# EAGLE design Converter (EAGLE 9.2.2)

## Sheet 1 of 4: Connectors & Caps
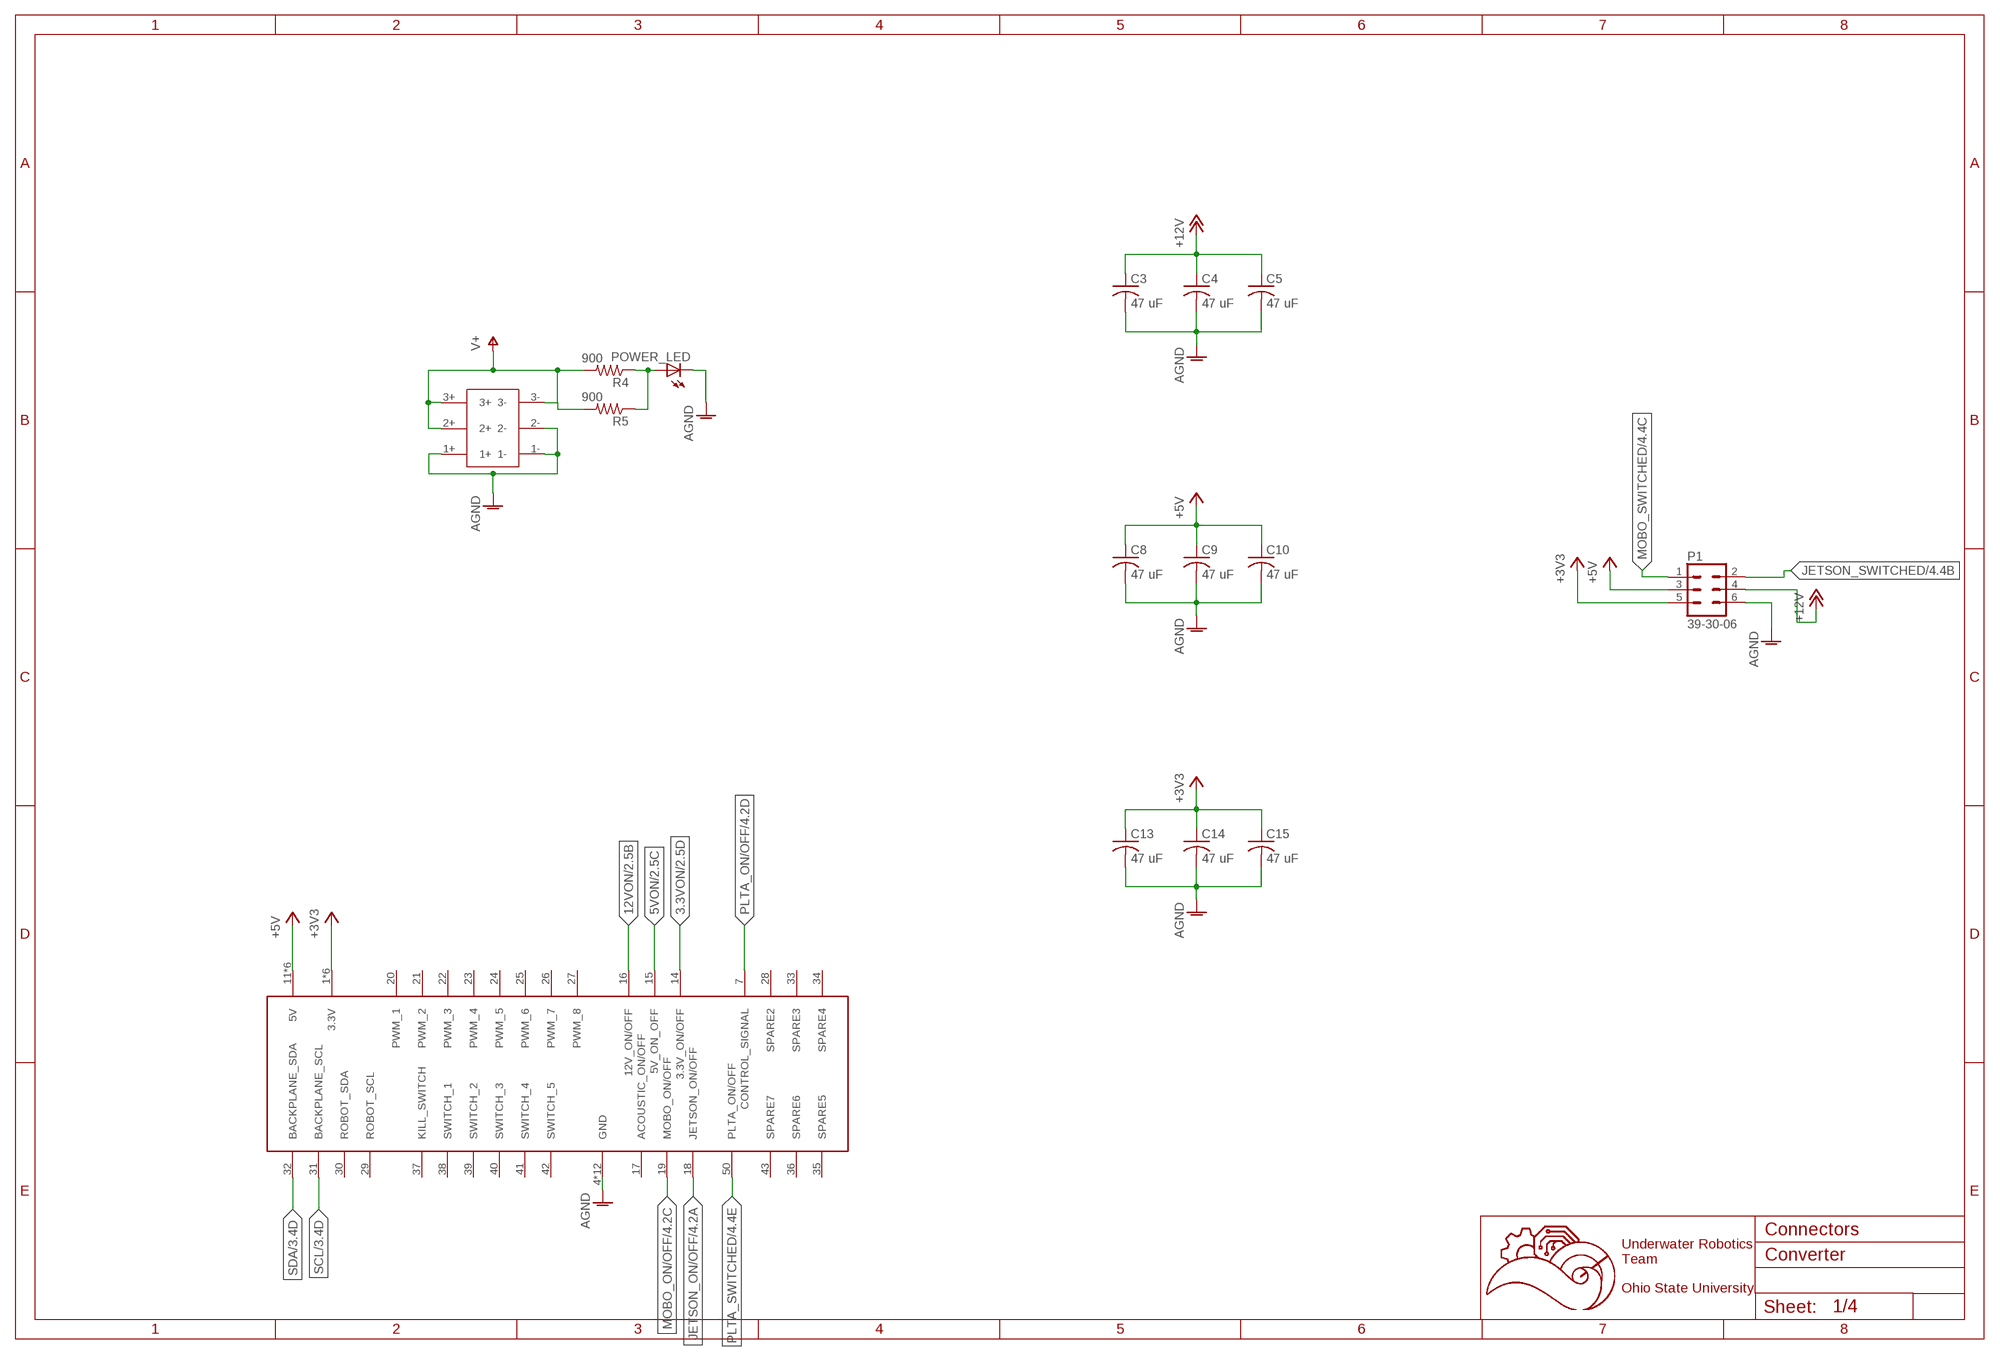
[diagram p0: schematic, sheet 1]

### Parts
C3  47 uF  C-USC1206K  [C1206K]
C4  47 uF  C-USC1206K  [C1206K]
C5  47 uF  C-USC1206K  [C1206K]
C8  47 uF  C-USC1206K  [C1206K]
C9  47 uF  C-USC1206K  [C1206K]
C10  47 uF  C-USC1206K  [C1206K]
C13  47 uF  C-USC1206K  [C1206K]
C14  47 uF  C-USC1206K  [C1206K]
C15  47 uF  C-USC1206K  [C1206K]
P1  39-30-06  [39-30-?06?]
POWER_LED  LEDCHIPLED_0603  [CHIPLED_0603]
R4  900  R-US_R0603  [R0603]
R5  900  R-US_R0603  [R0603]
U$1  5530843-EDGE  [5530843-6-BOARDFINGERS]
U$3  6PIN-VERT  [6PIN_VERT]

### Nets
3.3VON: U$1.14(3.3V_ON/OFF) ; also sheet 2
5VON: U$1.15(5V_ON_OFF) ; also sheet 2
12VON: U$1.16(12V_ON/OFF) ; also sheet 2
+3V3: C13.1 C14.1 C15.1 P1.5 U$1.1(3.3V) U$1.2(3.3V) U$1.3(3.3V) U$1.54(3.3V) U$1.55(3.3V) U$1.56(3.3V) ; also sheet 2,3
+5V: C8.1 C9.1 C10.1 P1.3 U$1.11(5V) U$1.12(5V) U$1.13(5V) U$1.44(5V) U$1.45(5V) U$1.46(5V) ; also sheet 2,3,4
+12V: C3.1 C4.1 C5.1 P1.4 ; also sheet 2,3,4
AGND: C3.2 C4.2 C5.2 C8.2 C9.2 C10.2 C13.2 C14.2 C15.2 P1.6 POWER_LED.C U$1.4(GND) U$1.5(GND) U$1.6(GND) U$1.8(GND) U$1.9(GND) U$1.10(GND) U$1.47(GND) U$1.48(GND) U$1.49(GND) U$1.51(GND) U$1.52(GND) U$1.53(GND) U$3.1+ U$3.1- U$3.2- ; also sheet 2,3,4
JETSON_ON/OFF: U$1.18(JETSON_ON/OFF) ; also sheet 4
JETSON_SWITCHED: P1.2 ; also sheet 4
MOBO_ON/OFF: U$1.19(MOBO_ON/OFF) ; also sheet 4
MOBO_SWITCHED: P1.1 ; also sheet 4
N$20: POWER_LED.A R4.1 R5.1
PLTA_ON/OFF: U$1.7(CONTROL_SIGNAL) ; also sheet 4
PLTA_SWITCHED: U$1.50(PLTA_ON/OFF) ; also sheet 4
SCL: U$1.31(BACKPLANE_SCL) ; also sheet 3
SDA: U$1.32(BACKPLANE_SDA) ; also sheet 3
V+: R4.2 R5.2 U$3.2+ U$3.3+ U$3.3- ; also sheet 2
Unconnected: U$1.17(ACOUSTIC_ON/OFF) U$1.20(PWM_1) U$1.21(PWM_2) U$1.22(PWM_3) U$1.23(PWM_4) U$1.24(PWM_5) U$1.25(PWM_6) U$1.26(PWM_7) U$1.27(PWM_8) U$1.28(SPARE2) U$1.29(ROBOT_SCL) U$1.30(ROBOT_SDA) U$1.33(SPARE3) U$1.34(SPARE4) U$1.35(SPARE5) U$1.36(SPARE6) U$1.37(KILL_SWITCH) U$1.38(SWITCH_1) U$1.39(SWITCH_2) U$1.40(SWITCH_3) U$1.41(SWITCH_4) U$1.42(SWITCH_5) U$1.43(SPARE7)

### Notes on the sheet
- Connectors
- Underwater Robotics
  Team
  
  Ohio State University

## Sheet 2 of 4: Converter
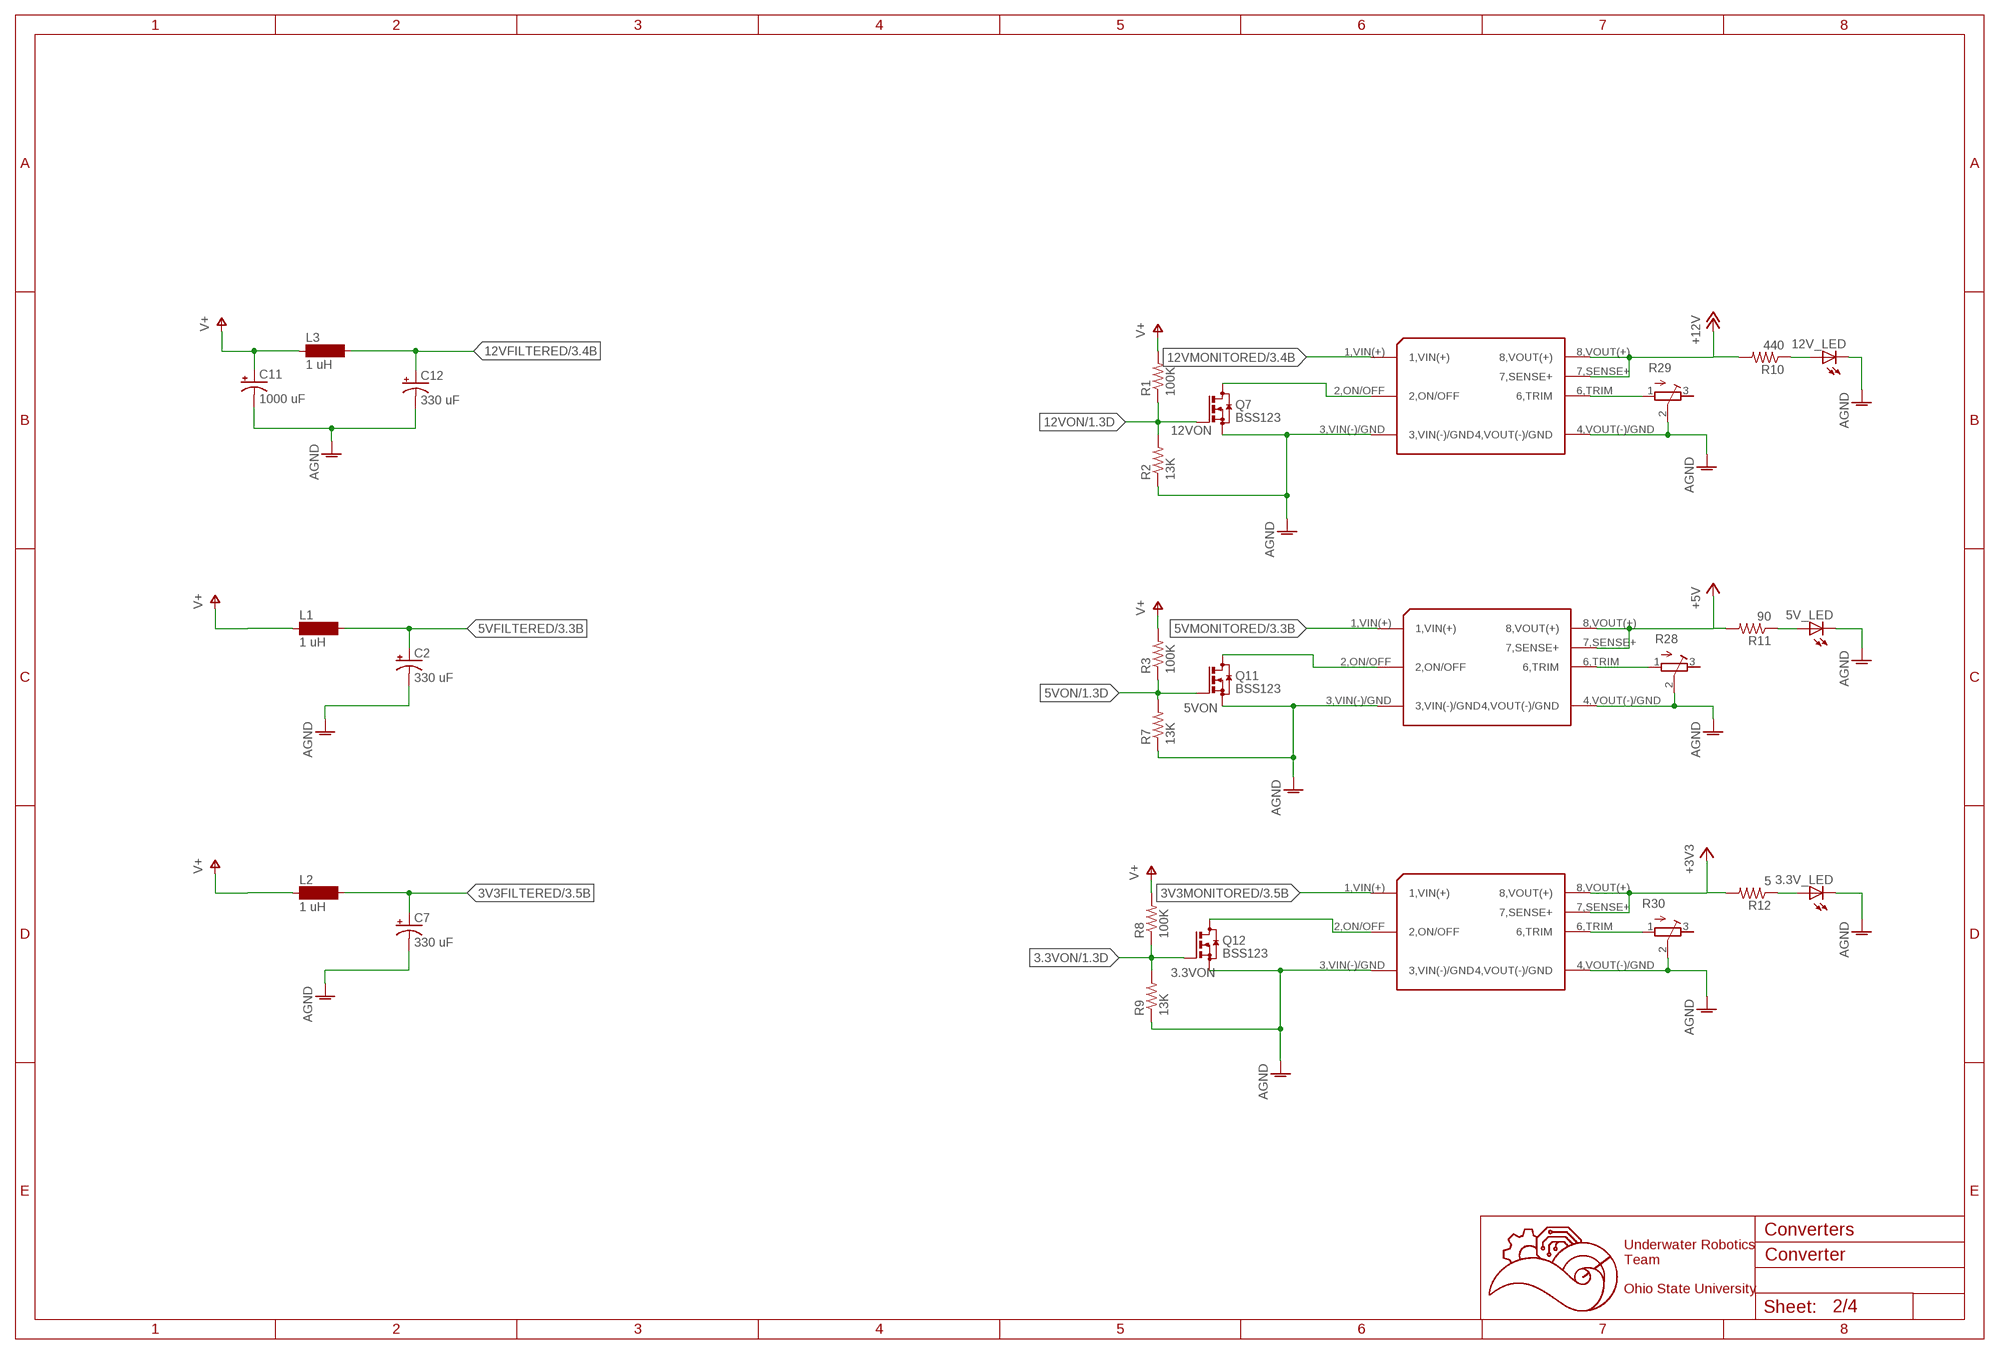
[diagram p1: schematic, sheet 2]

### Parts
3.3V_LED  LEDCHIPLED_0603  [CHIPLED_0603]
3.3VCONVERTER  CONVERTER  [CONVERTER]
5V_LED  LEDCHIPLED_0603  [CHIPLED_0603]
5VCONVERTER  CONVERTER  [CONVERTER]
12V_LED  LEDCHIPLED_0603  [CHIPLED_0603]
12VCONVERTER  CONVERTER  [CONVERTER]
C2  330 uF  CPOL-USE5-10.5  [E5-10,5]
C7  330 uF  CPOL-USE5-10.5  [E5-10,5]
C11  1000 uF  CPOL-USE5-13  [E5-13]
C12  330 uF  CPOL-USE5-10.5  [E5-10,5]
L1  1 uH  MS85  [MS85]
L2  1 uH  MS85  [MS85]
L3  1 uH  MS85  [MS85]
Q7  BSS123  [SOT23]
Q11  BSS123  [SOT23]
Q12  BSS123  [SOT23]
R1  100K  R-US_R0603  [R0603]
R2  13K  R-US_R0603  [R0603]
R3  100K  R-US_R0603  [R0603]
R7  13K  R-US_R0603  [R0603]
R8  100K  R-US_R0603  [R0603]
R9  13K  R-US_R0603  [R0603]
R10  440  R-US_R0603  [R0603]
R11  90  R-US_R0603  [R0603]
R12  5  R-US_R0603  [R0603]
R28  R-TRIMM3103  [RTRIM3103]
R29  R-TRIMM3103  [RTRIM3103]
R30  R-TRIMM3103  [RTRIM3103]

### Nets
3.3VON: Q12.1(G) R8.1 R9.2 ; also sheet 1
3V3FILTERED: C7.+ L2.2 ; also sheet 3
3V3MONITORED: 3.3VCONVERTER.1,VIN(+) ; also sheet 3
5VFILTERED: C2.+ L1.2 ; also sheet 3
5VMONITORED: 5VCONVERTER.1,VIN(+) ; also sheet 3
5VON: Q11.1(G) R3.1 R7.2 ; also sheet 1
12VFILTERED: C12.+ L3.2 ; also sheet 3
12VMONITORED: 12VCONVERTER.1,VIN(+) ; also sheet 3
12VON: Q7.1(G) R1.1 R2.2 ; also sheet 1
+3V3: 3.3VCONVERTER.7,SENSE+ 3.3VCONVERTER.8,VOUT(+) R12.2 ; also sheet 1,3
+5V: 5VCONVERTER.7,SENSE+ 5VCONVERTER.8,VOUT(+) R11.2 ; also sheet 1,3,4
+12V: 12VCONVERTER.7,SENSE+ 12VCONVERTER.8,VOUT(+) R10.2 ; also sheet 1,3,4
AGND: 3.3V_LED.C 3.3VCONVERTER.3,VIN(-)/GND 3.3VCONVERTER.4,VOUT(-)/GND 5V_LED.C 5VCONVERTER.3,VIN(-)/GND 5VCONVERTER.4,VOUT(-)/GND 12V_LED.C 12VCONVERTER.3,VIN(-)/GND 12VCONVERTER.4,VOUT(-)/GND C2.- C7.- C11.- C12.- Q7.2(S) Q11.2(S) Q12.2(S) R2.1 R7.1 R9.1 R28.2(S) R29.2(S) R30.2(S) ; also sheet 1,3,4
N$1: 12VCONVERTER.6,TRIM R29.1(A)
N$2: 5VCONVERTER.6,TRIM R28.1(A)
N$3: 3.3VCONVERTER.6,TRIM R30.1(A)
N$4: 3.3VCONVERTER.2,ON/OFF Q12.3(D)
N$5: 12V_LED.A R10.1
N$6: 5V_LED.A R11.1
N$7: 3.3V_LED.A R12.1
N$18: 12VCONVERTER.2,ON/OFF Q7.3(D)
N$19: 5VCONVERTER.2,ON/OFF Q11.3(D)
V+: C11.+ L1.1 L2.1 L3.1 R1.2 R3.2 R8.2 ; also sheet 1
Unconnected: R28.3(E) R29.3(E) R30.3(E)

### Notes on the sheet
- Converters
- Underwater Robotics
  Team
  
  Ohio State University
- C:/Users/blain/Downloads/Black and White.bmp

## Sheet 3 of 4
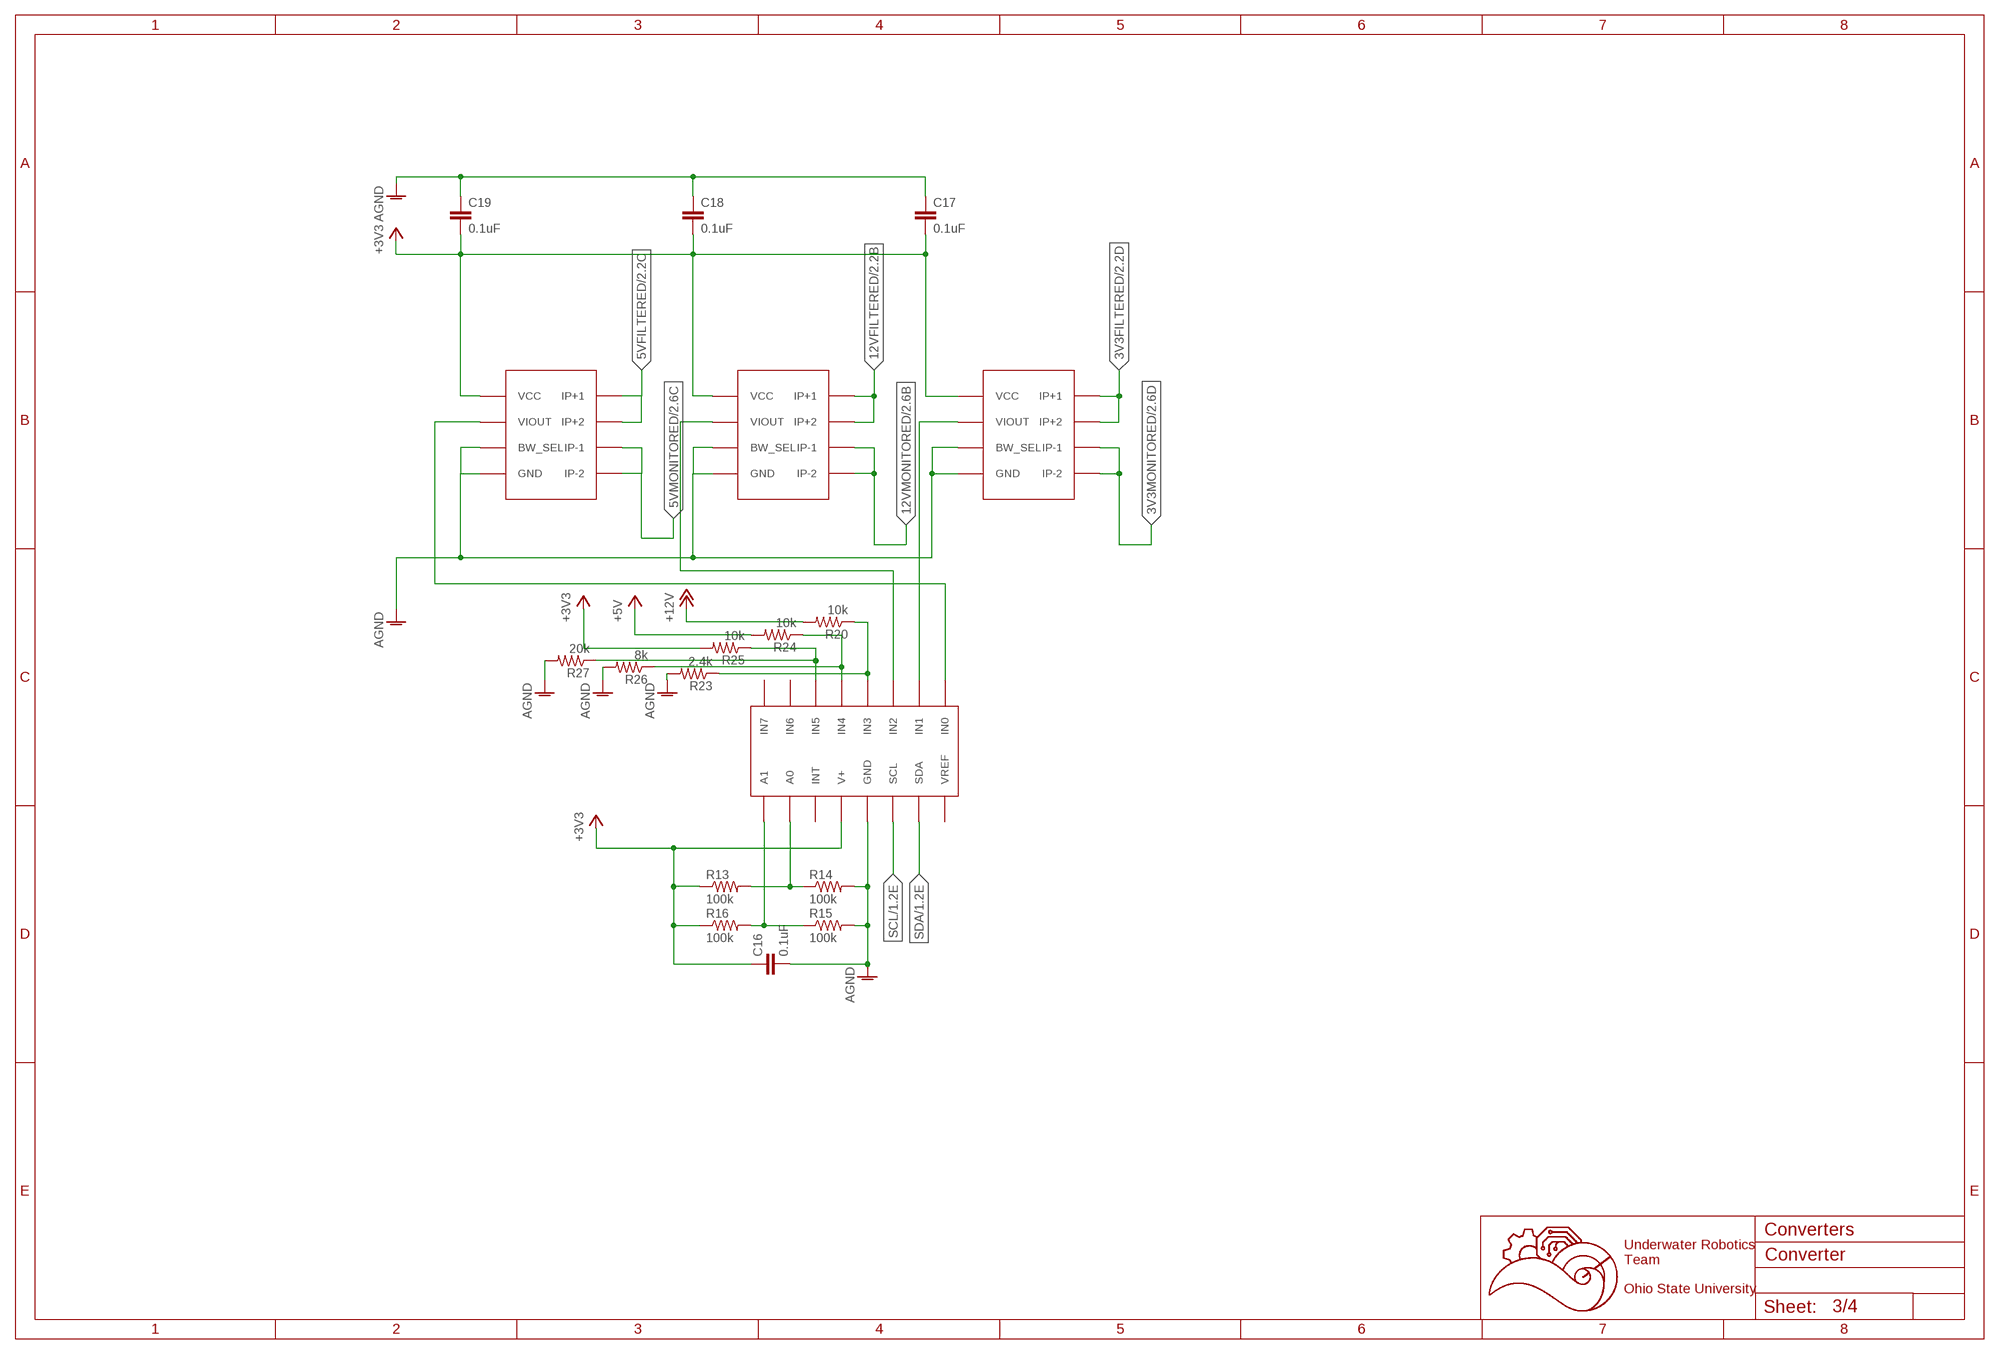
[diagram p2: schematic, sheet 3]

### Parts
1C  ACS722  [SOIC-8]
1C1  ACS722  [SOIC-8]
1C2  ACS722  [SOIC-8]
C16  0.1uF  C-EUC0603  [C0603]
C17  0.1uF  C-EUC0603  [C0603]
C18  0.1uF  C-EUC0603  [C0603]
C19  0.1uF  C-EUC0603  [C0603]
R13  100k  R-US_R0603  [R0603]
R14  100k  R-US_R0603  [R0603]
R15  100k  R-US_R0603  [R0603]
R16  100k  R-US_R0603  [R0603]
R20  10k  R-US_R0603  [R0603]
R23  2.4k  R-US_R0603  [R0603]
R24  10k  R-US_R0603  [R0603]
R25  10k  R-US_R0603  [R0603]
R26  8k  R-US_R0603  [R0603]
R27  20k  R-US_R0603  [R0603]
U$2  ADC128D818  [TSSOP-16]

### Nets
3V3FILTERED: 1C2.IP+1 1C2.IP+2 ; also sheet 2
3V3MONITORED: 1C2.IP-1 1C2.IP-2 ; also sheet 2
5VFILTERED: 1C.IP+1 1C.IP+2 ; also sheet 2
5VMONITORED: 1C.IP-1 1C.IP-2 ; also sheet 2
12VFILTERED: 1C1.IP+1 1C1.IP+2 ; also sheet 2
12VMONITORED: 1C1.IP-1 1C1.IP-2 ; also sheet 2
+3V3: 1C1.VCC 1C2.VCC 1C.VCC C16.1 C17.2 C18.2 C19.2 R13.1 R16.1 R25.2 U$2.V+ ; also sheet 1,2
+5V: R24.2 ; also sheet 1,2,4
+12V: R20.2 ; also sheet 1,2,4
AGND: 1C1.BW_SEL 1C1.GND 1C2.BW_SEL 1C2.GND 1C.BW_SEL 1C.GND C16.2 C17.1 C18.1 C19.1 R14.2 R15.2 R23.2 R26.2 R27.2 U$2.GND ; also sheet 1,2,4
N$11: 1C.VIOUT U$2.IN0
N$12: 1C1.VIOUT U$2.IN2
N$13: 1C2.VIOUT U$2.IN1
N$16: R24.1 R26.1 U$2.IN4
N$17: R25.1 R27.1 U$2.IN5
N$21: R20.1 R23.1 U$2.IN3
N$44: R13.2 R14.1 U$2.A0
N$46: R15.1 R16.2 U$2.A1
SCL: U$2.SCL ; also sheet 1
SDA: U$2.SDA ; also sheet 1
Unconnected: U$2.IN6 U$2.IN7 U$2.INT U$2.VREF

### Notes on the sheet
- Converters
- Underwater Robotics
  Team
  
  Ohio State University
- C:/Users/blain/Downloads/Black and White.bmp

## Sheet 4 of 4
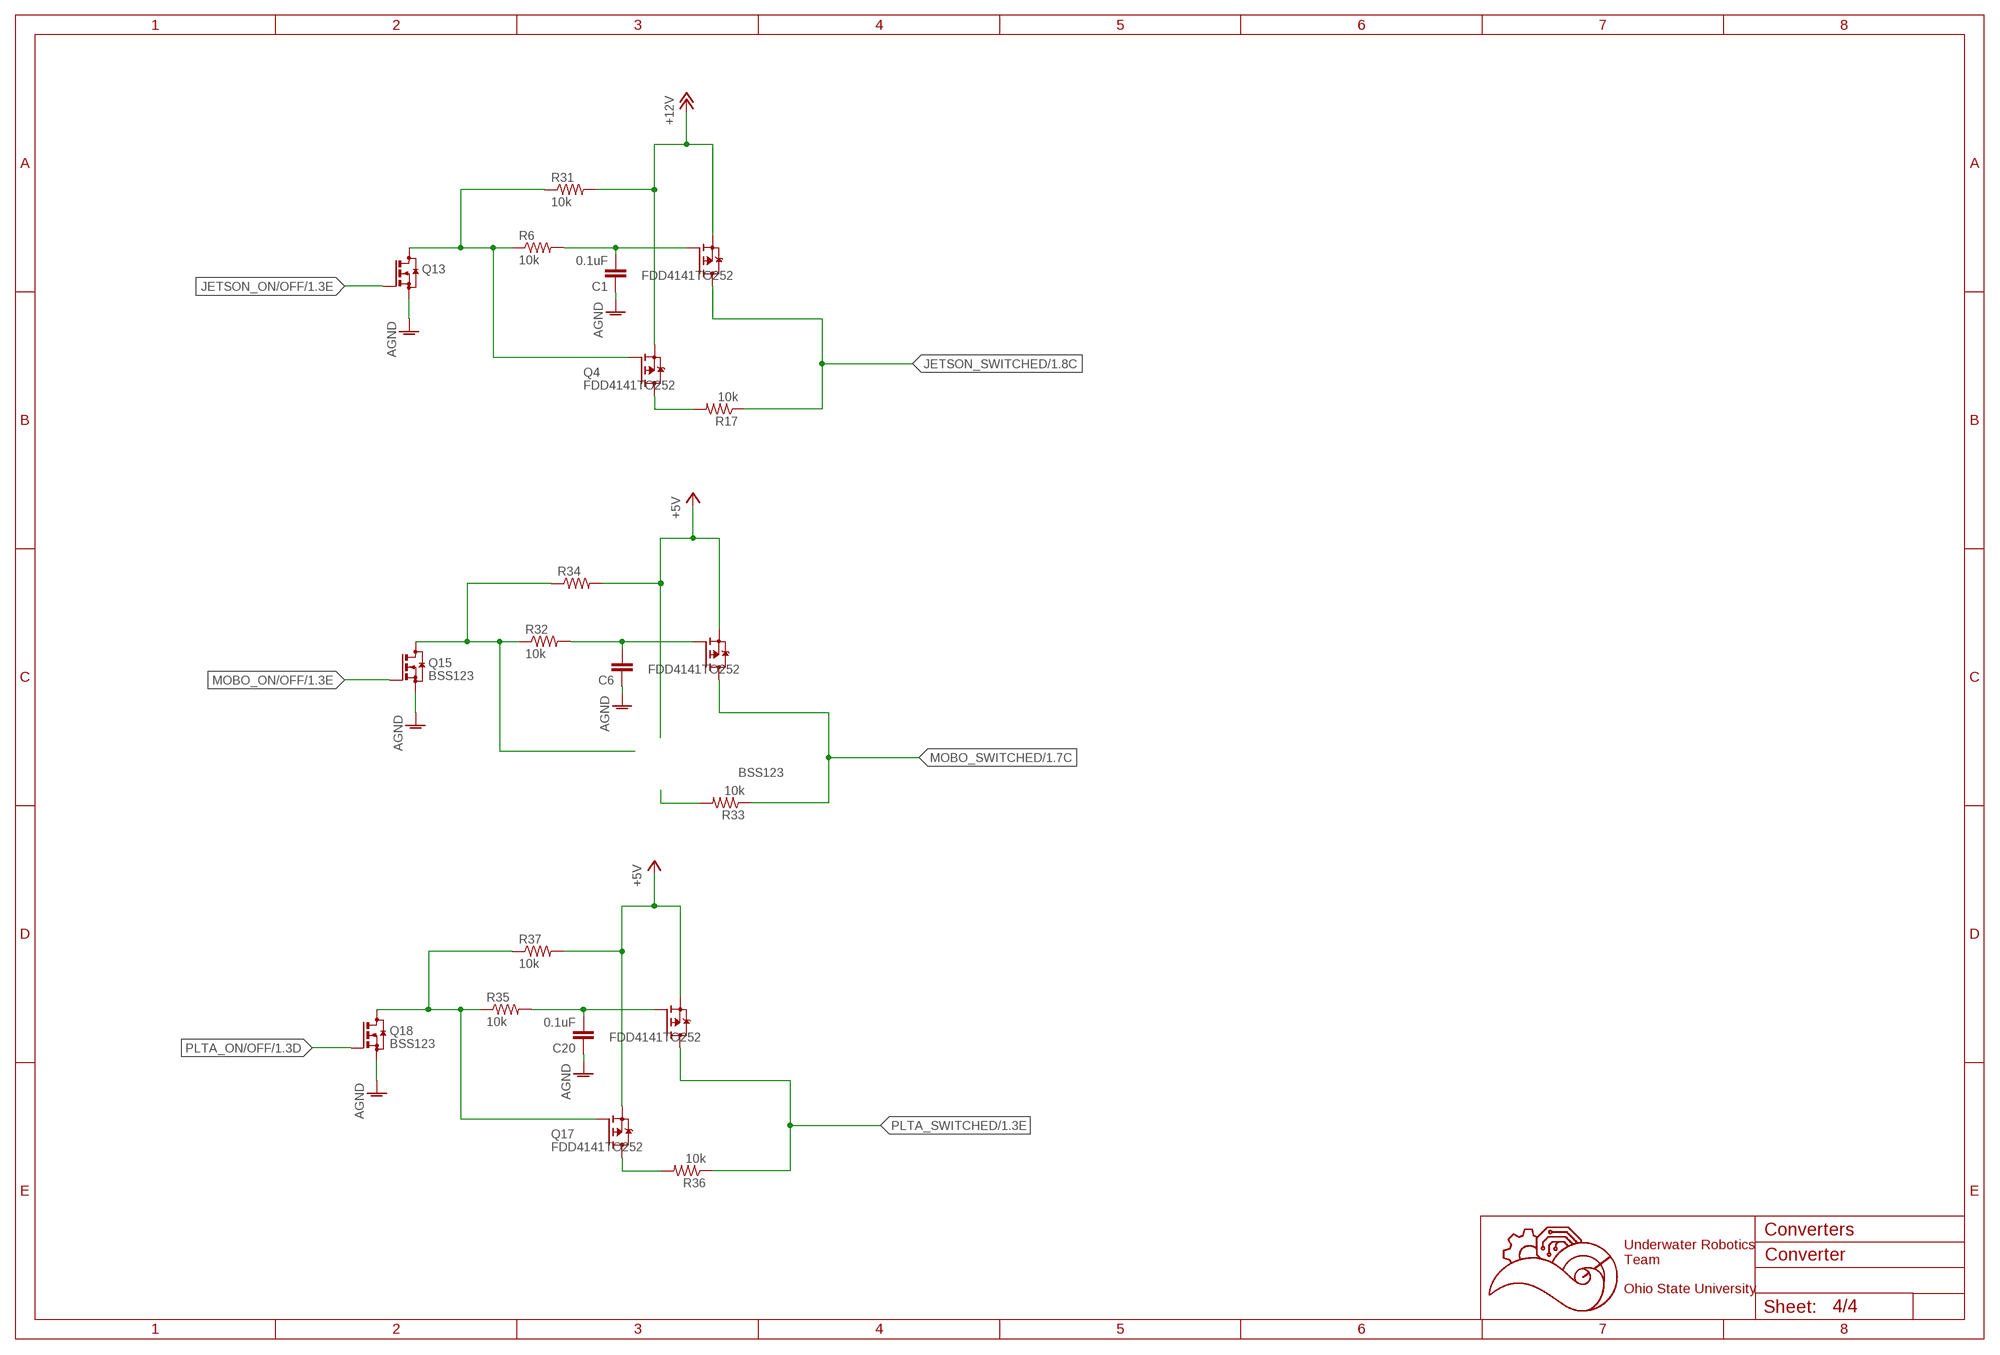
[diagram p3: schematic, sheet 4]

### Parts
C1  0.1uF  C-EUC0603  [C0603]
C6  0.1uF  C-EUC0603  [C0603]
C20  0.1uF  C-EUC0603  [C0603]
Q1  FDD4141TO252  [TO252]
Q4  FDD4141TO252  [TO252]
Q5  FDD4141TO252  [TO252]
Q13  BSS123  [SOT23]
Q15  BSS123  [SOT23]
Q16  FDD4141TO252  [TO252]
Q17  FDD4141TO252  [TO252]
Q18  BSS123  [SOT23]
R6  10k  R-US_R0603  [R0603]
R17  10k  R-US_R0603  [R0603]
R31  10k  R-US_R0603  [R0603]
R32  10k  R-US_R0603  [R0603]
R33  10k  R-US_R0603  [R0603]
R34  10k  R-US_R0603  [R0603]
R35  10k  R-US_R0603  [R0603]
R36  10k  R-US_R0603  [R0603]
R37  10k  R-US_R0603  [R0603]

### Nets
+5V: Q5.2(S) Q16.2(S) Q17.2(S) R34.2 R37.2 ; also sheet 1,2,3
+12V: Q1.2(S) Q4.2(S) R31.2 ; also sheet 1,2,3
AGND: C1.1 C6.1 C20.1 Q13.2(S) Q15.2(S) Q18.2(S) ; also sheet 1,2,3
JETSON_ON/OFF: Q13.1(G) ; also sheet 1
JETSON_SWITCHED: Q1.3(D) R17.1 ; also sheet 1
MOBO_ON/OFF: Q15.1(G) ; also sheet 1
MOBO_SWITCHED: Q5.3(D) R33.1 ; also sheet 1
N$15: Q4.1(G) Q13.3(D) R6.1 R31.1
N$22: Q4.3(D) R17.2
N$23: C1.2 Q1.1(G) R6.2
N$24: Q15.3(D) R32.1 R34.1
N$25: C6.2 Q5.1(G) R32.2
N$26: R33.2
N$27: Q17.1(G) Q18.3(D) R35.1 R37.1
N$28: C20.2 Q16.1(G) R35.2
N$29: Q17.3(D) R36.2
PLTA_ON/OFF: Q18.1(G) ; also sheet 1
PLTA_SWITCHED: Q16.3(D) R36.1 ; also sheet 1

### Notes on the sheet
- Converters
- Underwater Robotics
  Team
  
  Ohio State University
- C:/Users/blain/Downloads/Black and White.bmp

## Library data of the parts
1C 1C1 1C2 = ACS722:ACS722
3.3V_LED 5V_LED 12V_LED POWER_LED = led:LED: LED OSRAM: - CHIPLED LG R971, LG N971, LY N971, LG Q971, LY Q971, LO R971, LY R971 LH N974, LH R974 LS Q976, LO Q976, LY Q976 LO Q996 - Hyper CHIPLED LW Q18S LB Q993, LB Q99A, LB R99A - SideLED LS A670, LO A670, LY A670, LG A670, LP A670 LB A673, LV A673, LT A673, LW A673 LH A674 LY A675 LS A676, LA A676, LO A676, LY A676, LW A676 LS A679, LY A679, LG A679 - Hyper Micro SIDELED® LS Y876, LA Y876, LO Y876, LY Y876 LT Y87S - SmartLED LW L88C, LW L88S LB L89C, LB L89S, LG L890 LS L89K, LO L89K, LY L89K LS L896, LA L896, LO L896, LY L896 - TOPLED LS T670, LO T670, LY T670, LG T670, LP T670 LSG T670, LSP T670, LSY T670, LOP T670, LYG T670 LG T671, LOG T671, LSG T671 LB T673, LV T673, LT T673, LW T673 LH T674 LS T676, LA T676, LO T676, LY T676, LB T676, LH T676, LSB T676, LW T676 LB T67C, LV T67C, LT T67C, LS T67K, LO T67K, LY T67K, LW E67C LS E67B, LA E67B, LO E67B, LY E67B, LB E67C, LV E67C, LT E67C LW T67C LS T679, LY T679, LG T679 LS T770, LO T770, LY T770, LG T770, LP T770 LB T773, LV T773, LT T773, LW T773 LH T774 LS E675, LA E675, LY E675, LS T675 LS T776, LA T776, LO T776, LY T776, LB T776 LHGB T686 LT T68C, LB T68C - Hyper Mini TOPLED® LB M676 - Mini TOPLED Santana® LG M470 LS M47K, LO M47K, LY M47K Source: http://www.osram.convergy.de LUXEON: - LUMILED® LXK2-PW12-R00, LXK2-PW12-S00, LXK2-PW14-U00, LXK2-PW14-V00 LXK2-PM12-R00, LXK2-PM12-S00, LXK2-PM14-U00 LXK2-PE12-Q00, LXK2-PE12-R00, LXK2-PE12-S00, LXK2-PE14-T00, LXK2-PE14-U00 LXK2-PB12-K00, LXK2-PB12-L00, LXK2-PB12-M00, LXK2-PB14-N00, LXK2-PB14-P00, LXK2-PB14-Q00 LXK2-PR12-L00, LXK2-PR12-M00, LXK2-PR14-Q00, LXK2-PR14-R00 LXK2-PD12-Q00, LXK2-PD12-R00, LXK2-PD12-S00 LXK2-PH12-R00, LXK2-PH12-S00 LXK2-PL12-P00, LXK2-PL12-Q00, LXK2-PL12-R00 Source: www.luxeon.com KINGBRIGHT: KA-3528ASYC Source: www.kingbright.com
3.3VCONVERTER 5VCONVERTER 12VCONVERTER = converter:CONVERTER
C1 C6 C16-C20 = rcl:C-EU: CAPACITOR, European symbol; SPICEPREFIX: C
C2 C7 C11 C12 = rcl:CPOL-US: POLARIZED CAPACITOR, American symbol; SPICEPREFIX: C
C3-C5 C8-C10 C13-C15 = resistor:C-US: CAPACITOR, American symbol
L1-L3 = inductor-neosid:MS85: INDUCTOR SMD power inductor; OC_FARNELL: unknown; OC_NEWARK: unknown
P1 = con-molex-mini-fit:39-30-?06?: HEADER
Q1 Q4 Q5 Q16 Q17 = transistor-fet:FDD4141: P-Channel PowerTrench® MOSFET Source: FDD4141.pdf
Q7 Q11-Q13 Q15 Q18 = transistor-small-signal:BSS123: N-CHANNEL MOS FET
R1-R5 R7-R12 = rcl:R-US_: RESISTOR, American symbol; SPICEPREFIX: R
R6 R13-R17 R20 R23-R27 R31-R37 = resistor:R-US_: RESISTOR, American symbol
R28-R30 = rcl:R-TRIMM: Trimm resistor; SPICEMODEL: X; SPICEPREFIXL: POT
U$1 = 5530843-6:5530843-EDGE
U$2 = ADC128D818:ADC128D818
U$3 = Vertical_Connectors:6PIN-VERT

## Board
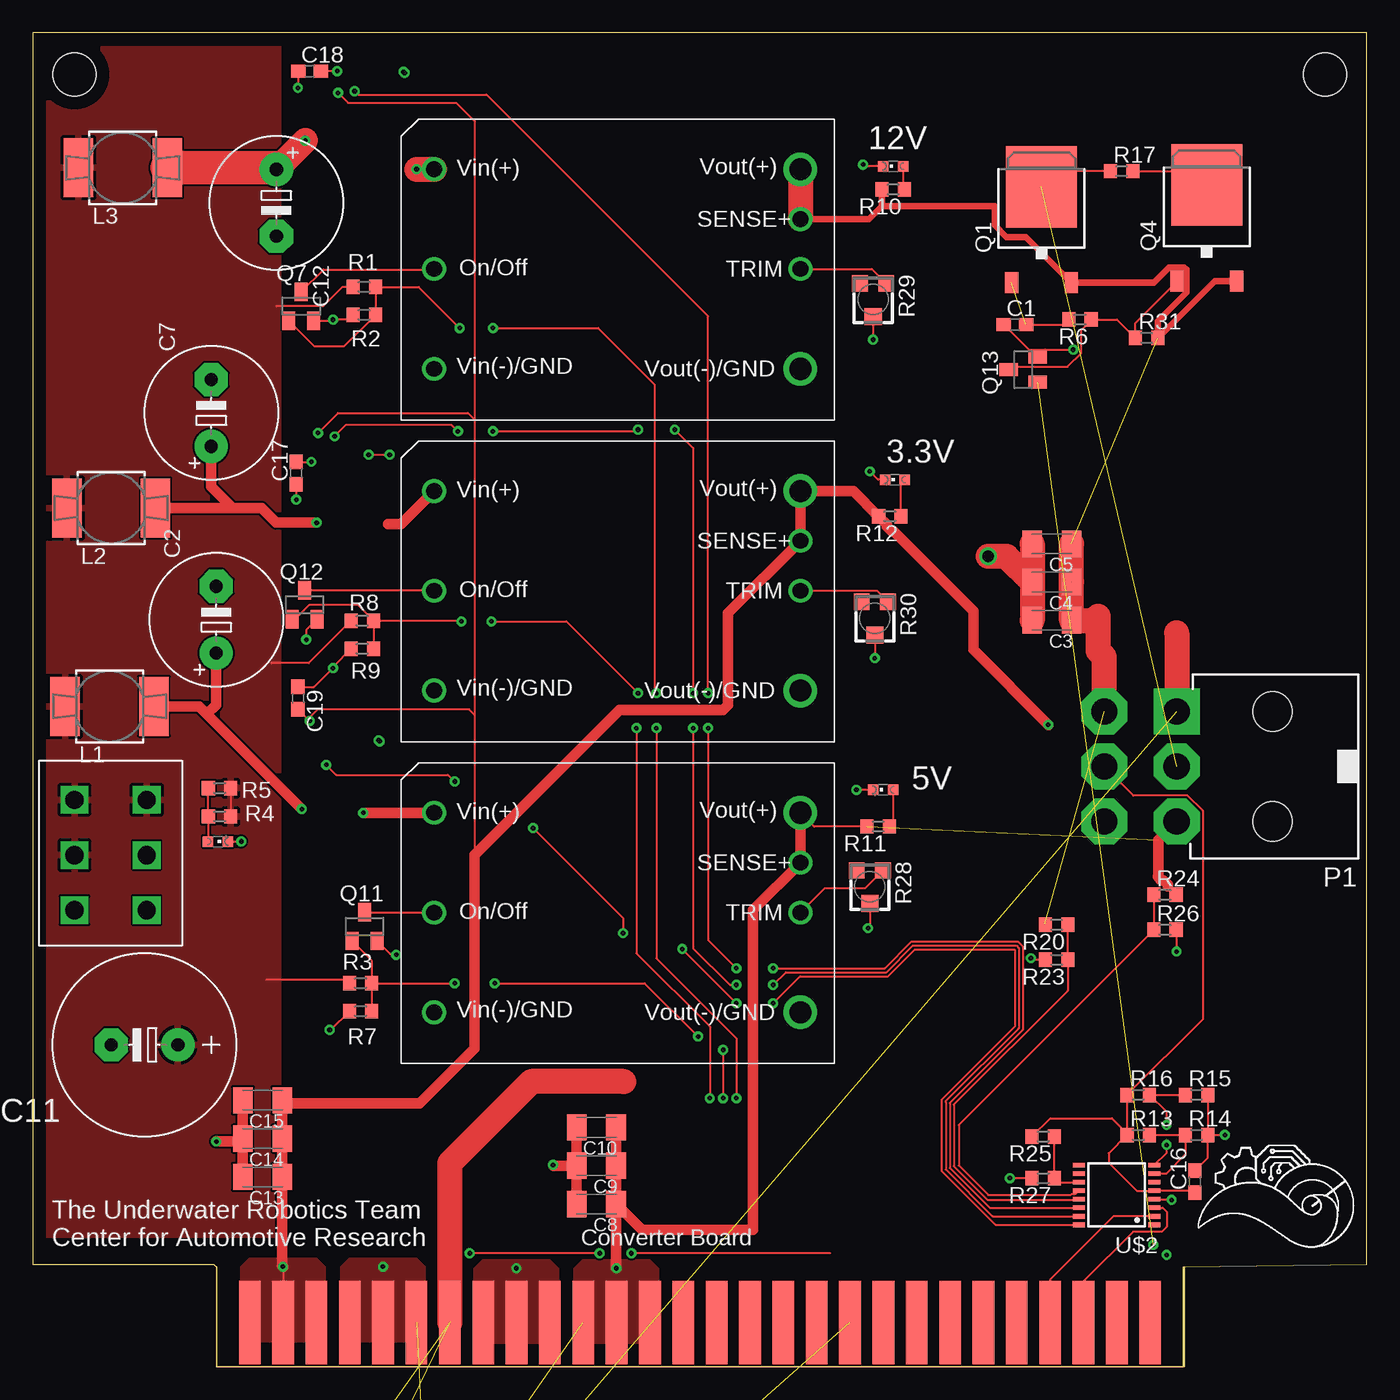
[diagram p4: board, top side]
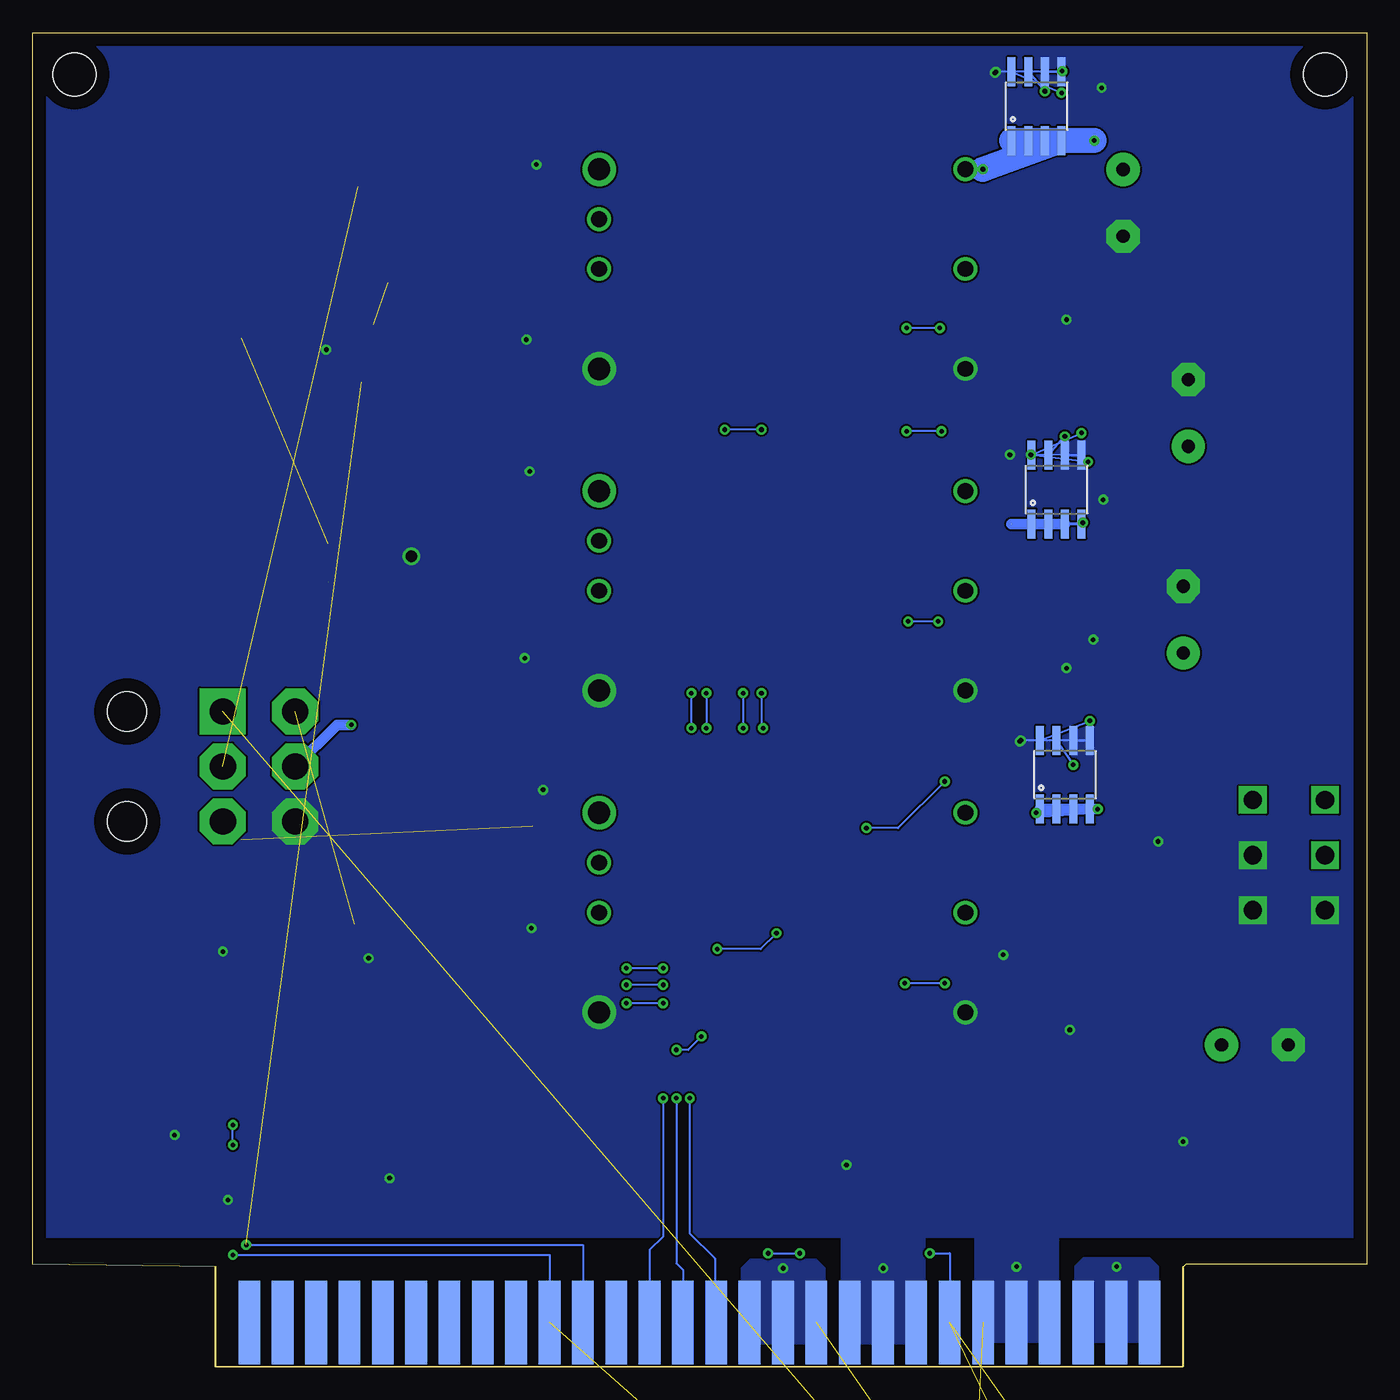
[diagram p5: board, bottom side, seen from below]

Size 101.6 x 101.6 mm. Coordinates in mm from the lower left corner, seen from the top.
Outline: 0,7.8 13.79,7.8 13.97,7.62 13.97,0 87.63,0 87.63,7.62 101.6,7.8 101.6,101.6 0,101.6 0,7.8
Copper layers (1*16): Top 0.035mm / dielectric 1.5mm / Bottom 0.035mm
Design rules "default": minimum track width 6mil, minimum drill 0.35mm, track to track 6mil, track to pad 6mil, pad to pad 6mil, via to via 6mil, smd to smd 6mil, copper to edge 40mil, drill to drill 6mil, minimum pad ring 10mil, minimum via ring 8mil, stop-mask expansion 4mil, vias tented up to drill 0mil, thermal gap 10mil
Holes 3.26 mm at 3.17,98.42 98.42,98.42

### Footprints (pad centres in the part's own frame; a part is rotated, then mirrored left to right if it is on the bottom)
SOIC-8 = smd 0.61 x 2.21: BW_SEL 0.635,2.616; GND 1.905,2.616; IP+1 -1.905,-2.616; IP+2 -0.635,-2.616; IP-1 0.635,-2.616; IP-2 1.905,-2.616; VCC -1.905,2.616; VIOUT -0.635,2.616
CHIPLED_0603 = smd 0.8 x 0.8: A 0,-0.75; C 0,0.75
CONVERTER = drill 1.2: 1,VIN(+) 2.5,19.1; 2,ON/OFF 2.5,11.5; 3,VIN(-)/GND 2.5,3.9; 6,TRIM 30.4,11.5; 7,SENSE+ 30.4,15.3 | drill 1.7: 4,VOUT(-)/GND 30.4,3.9; 8,VOUT(+) 30.4,19.1
C0603 = smd 1.1 x 1: 1 -0.85,0; 2 0.85,0
E5-10,5 = drill 1.016 pad 2.54: + -2.54,0 | drill 1.016 pad 2.54 octagon: - 2.54,0
C1206K = smd 1.5 x 2: 1 -1.5,0; 2 1.5,0
E5-13 = drill 1.016 pad 2.54: + -2.54,0 | drill 1.016 pad 2.54 octagon: - 2.54,0
MS85 = smd 4.5 x 2.25: 1 0,-3.383; 2 0,3.383
39-30-?06? = drill 2 pad 3.5 square: 1 4.191,0 | drill 2 pad 3.5 octagon: 2 0,0; 3 -4.191,0; 4 4.191,5.512; 5 0,5.512; 6 -4.191,5.512 | hole 3: -4.191,-7.3; 4.191,-7.3
TO252 = smd 1 x 1.6: 1 -2.28,-4.8; 2 2.28,-4.8 | smd 5.4 x 6.2: 3 0,2.5
SOT23 = smd 1 x 1.4: 1 -0.95,-1.1; 2 0.95,-1.1; 3 0,1.1
R0603 = smd 1 x 1.1: 1 -0.85,0; 2 0.85,0
RTRIM3103 = smd 1.2 x 1.25: 1 -1,-1.225; 3 1,-1.225 | smd 1.3 x 1.3: 2 0,1.3
5530843-6-BOARDFINGERS = smd 1.651 x 6.35 bottom: 1 0.826,3.375; 2 3.365,3.375; 3 5.905,3.375; 4 8.445,3.375; 5 10.986,3.375; 6 13.525,3.375; 7 16.066,3.375; 8 18.605,3.375; 9 21.145,3.375; 10 23.686,3.375; 11 26.226,3.375; 12 28.765,3.375; 13 31.305,3.375; 14 33.846,3.375; 15 36.386,3.375; 16 38.925,3.375; 17 41.465,3.375; 18 44.005,3.375; 19 46.545,3.375; 20 49.086,3.375; 21 51.626,3.375; 22 54.166,3.375; 23 56.706,3.375; 24 59.245,3.375; 25 61.785,3.375; 26 64.326,3.375; 27 66.865,3.375; 28 69.406,3.375 | smd 1.651 x 6.35: 29 69.406,3.375; 30 66.865,3.375; 31 64.326,3.375; 32 61.785,3.375; 33 59.245,3.375; 34 56.706,3.375; 35 54.166,3.375; 36 51.626,3.375; 37 49.086,3.375; 38 46.545,3.375; 39 44.005,3.375; 40 41.465,3.375; 41 38.925,3.375; 42 36.386,3.375; 43 33.846,3.375; 44 31.305,3.375; 45 28.765,3.375; 46 26.226,3.375; 47 23.686,3.375; 48 21.145,3.375; 49 18.605,3.375; 50 16.066,3.375; 51 13.525,3.375; 52 10.986,3.375; 53 8.445,3.375; 54 5.905,3.375; 55 3.365,3.375; 56 0.826,3.375
TSSOP-16 = smd 0.9 x 0.35: A0 -2.875,-1.625; A1 -2.875,-2.275; GND -2.875,0.325; IN0 2.875,2.275; IN1 2.875,1.625; IN2 2.875,0.975; IN3 2.875,0.325; IN4 2.875,-0.325; IN5 2.875,-0.975; IN6 2.875,-1.625; IN7 2.875,-2.275; INT -2.875,-0.975; SCL -2.875,0.975; SDA -2.875,1.625; V+ -2.875,-0.325; VREF -2.875,2.275
6PIN_VERT = drill 1.4 square: 1+ 0,0; 1- 5.5,0; 2+ 0,4.2; 2- 5.5,4.2; 3+ 0,8.4; 3- 5.5,8.4

### Placement (x,y rotation side)
1C  22.99,45.09 0 bottom
1C1  25.15,96.01 0 bottom
1C2  23.62,66.8 0 bottom
3.3V_LED  65.66,67.56 90 top
3.3VCONVERTER  28.07,47.6 0 top
5V_LED  64.77,43.94 90 top
5VCONVERTER  28.07,23.09 0 top
12V_LED  65.53,91.44 90 top
12VCONVERTER  28.07,72.11 0 top
C1  74.8,79.38 0 top
C2  13.97,56.9 90 top
C3  77.62,56.85 180 top
C4  77.62,59.77 180 top
C5  77.62,62.69 180 top
C6  12.19,-41.15 0 top  (outside the outline)
C7  13.59,72.64 90 top
C8  42.93,12.4 180 top
C9  42.93,15.32 180 top
C10  42.93,18.24 180 top
C11  8.51,24.51 180 top
C12  18.54,88.65 270 top
C13  17.5,14.45 180 top
C14  17.5,17.37 180 top
C15  17.5,20.29 180 top
C16  88.52,14.1 90 top
C17  20.07,68.07 90 top
C18  21.08,98.68 0 top
C19  20.19,50.93 270 top
C20  18.16,-41.15 0 top  (outside the outline)
L1  5.84,50.29 270 top
L2  5.97,65.41 270 top
L3  6.86,91.31 270 top
P1  39-30-06?  [39-30-?06?]  87.12,45.72 90 top
POWER_LED  14.1,40.01 270 top
Q1  76.83,87.38 0 top
Q4  89.41,87.5 0 top
Q5  -36.58,-7.75 0 top  (outside the outline)
Q7  20.45,80.77 0 top
Q11  25.27,33.53 0 top
Q12  20.7,58.04 0 top
Q13  75.44,75.95 90 top
Q15  29.72,-25.15 0 top  (outside the outline)
Q16  25.4,-12.32 0 top  (outside the outline)
Q17  14.1,-32.64 0 top  (outside the outline)
Q18  -0.51,-42.42 0 top  (outside the outline)
R1  25.25,82.25 180 top
R2  25.25,80.11 0 top
R3  24.97,29.21 180 top
R4  14.22,41.91 0 top
R5  14.22,44.07 0 top
R6  79.76,79.76 180 top
R7  24.97,27.08 0 top
R8  25.1,56.82 180 top
R9  25.1,54.69 0 top
R10  65.53,89.66 180 top
R11  64.39,41.15 180 top
R12  65.28,64.77 180 top
R13  84.2,17.65 0 top
R14  88.65,17.65 0 top
R15  88.65,20.7 0 top
R16  84.2,20.7 0 top
R17  82.93,91.06 0 top
R20  77.98,33.66 180 top
R23  77.98,30.99 180 top
R24  86.23,35.94 0 top
R25  76.96,17.53 180 top
R26  86.23,33.27 0 top
R27  76.96,14.35 180 top
R28  63.75,36.58 180 top
R29  64.01,81.28 180 top
R30  64.14,57.02 180 top
R31  84.84,78.36 0 top
R32  -1.4,-48.64 0 top  (outside the outline)
R33  3.3,-48.64 0 top  (outside the outline)
R34  8,-48.64 0 top  (outside the outline)
R35  12.7,-48.64 0 top  (outside the outline)
R36  17.4,-48.64 0 top  (outside the outline)
R37  22.1,-48.64 0 top  (outside the outline)
U$1  15.7,0 0 top
U$2  82.55,13.08 180 top
U$3  3.17,34.77 0 top

### Tracks (layer width: path | path; a pad name or v marks a point on that pad's centre or on a via)
3.3VON  (via drill 0.35)
  Top 0.152: R8.1 R9.2 | v45.97,48.64 45.97,31.5 51.56,25.91 v51.56,20.45 | Q12.1 19.98,56.94 21.08,58.04 24.73,58.04 R8.1 | R8.1 32.59,56.82 v32.64,56.77 | v34.92,56.77 40.64,56.77 v46.1,51.31
  Bottom 0.152: U$1.14 49.66,3.29 49.66,8.26 51.56,10.16 v51.56,20.45 | v46.1,51.31 46.1,48.77 v45.97,48.64 | v32.64,56.77 v34.92,56.77
3V3FILTERED  (via drill 0.35)
  Top 0.813: 13.5,69.55 C7.+ 13.59,67.06 15.24,65.41 | v21.61,64.29 18.54,64.29 17.42,65.41 15.24,65.41 | L2.2 15.24,65.41
  Bottom 0.152: 1C2.IP+1 v21.61,64.29
  Bottom 0.813: 1C2.IP+1 1C2.IP+2
3V3MONITORED  (1 unrouted)
  Top 0.813: 27.05,64.19 28.05,64.19 3.3VCONVERTER.1,VIN(+)
  Bottom 0.152: 1C2.IP-1 1C2.IP-2 27.05,64.19
  Bottom 0.813: 1C2.IP-1 27.05,64.19
5VFILTERED  (via drill 0.35)
  Top 0.813: L1.2 12.67,50.29 13.26,49.7 | 13.26,49.7 v20.49,42.47 | C2.+ 13.97,50.42 13.26,49.7
  Bottom 0.813: v20.49,42.47 1C.IP+1 1C.IP+2
5VMONITORED  (via drill 0.35)
  Top 0.813: v25.17,42.19 5VCONVERTER.1,VIN(+)
  Bottom 0.813: 1C.IP-1 1C.IP-2 v25.17,42.19
5VON  (via drill 0.35)
  Top 0.152: R3.1 25.82,27.29 25.91,27.2 26.04,27.2 25.91,27.08 R7.2 | Q11.1 25.82,30.93 R3.1 | R3.1 v32.13,29.21 | v35.18,29.21 46.61,29.21 v50.67,25.15 | v52.58,24.13 v52.58,20.45
  Bottom 0.152: 52.58,3.87 U$1.15 52.09,7.38 52.58,7.87 v52.58,20.45 | v32.13,29.21 v35.18,29.21 | v50.67,25.15 51.69,24.13 v52.58,24.13
12VFILTERED  (via drill 0.35)
  Top 1.905: C12.+ v20.75,93.4
  Top 2.54: C12.+ 18.41,91.31 L3.2
  Bottom 0.813: 1C1.IP+2 1C1.IP+1
  Bottom 1.905: v20.75,93.4 1C1.IP+1
12VMONITORED  (via drill 0.35)
  Top 1.905: v29.24,91.21 12VCONVERTER.1,VIN(+)
  Bottom 0.813: 1C1.IP-1 1C1.IP-2
  Bottom 1.905: 1C1.IP-2 v29.24,91.21
12VON  (via drill 0.35)
  Top 0.152: v47.5,48.64 47.5,31.11 53.59,25.02 v53.59,20.45 | v32.51,79.12 29.39,82.25 R1.1 R2.2 23.71,77.72 21.45,77.72 Q7.1 | v35.05,79.12 43.05,79.12 47.37,74.8 47.37,51.44 v47.5,51.31
  Bottom 0.152: v47.5,51.31 v47.5,48.64 | v53.59,20.45 53.59,9.91 54.61,8.89 54.61,3.39 U$1.16 | v32.51,79.12 v35.05,79.12
+3V3  (via drill 0.35)
  Top 0.152: 19,20.07 19,17.53 C14.1 C13.1 | v19.05,7.62 19.05,3.39 U$1.55 | 83.35,17.78 R16.1 89.1,26.45 89.1,42.35 87.94,43.51 83.82,43.51 P1.5 | 83.35,17.78 R13.1 81.96,16.26 81.96,15.54 84.09,13.41 U$2.V+ 88.36,13.41 C16.1 | v21.08,49.19 20.97,49.3 | 20.97,49.3 C19.2 | C17.2 v21.22,68.92 | v23.19,98.68 C18.2 | 33.66,72.14 33.66,94.87 32.26,96.27 24,96.27 v23.24,97.03 | 33.66,72.14 33.66,49.66 | 33.66,49.66 33.66,38.99 | v21.72,71.12 23.24,72.64 33.15,72.64 33.66,72.14 | 33.66,49.66 33.25,50.06 21.69,50.06 20.97,49.35 20.97,49.3 | 83.35,17.78 82.21,18.92 77.51,18.92 R25.2
  Top 0.813: v77.34,48.9 71.63,54.61 71.63,57.57 65.54,63.66 65.4,63.66 65.07,63.99 65.07,64.13 R12.2 62.5,66.7 3.3VCONVERTER.8,VOUT(+) 3.3VCONVERTER.7,SENSE+ 52.97,57.4 52.97,50.42 52.59,50.04 44.7,50.04 33.66,38.99 33.66,24.26 29.46,20.07 19,20.07 | v19.05,7.62 19,7.67 C13.1 19,17.53 | C14.1 19,20.07 | 19,20.07 C15.1
  Bottom 0.152: v21.22,68.92 1C2.VCC v21.72,71.12 | v23.19,98.68 1C1.VCC v23.24,97.03 | 1C.VCC v21.08,49.19
  Bottom 0.813: v77.34,48.9 78.44,48.9 P1.5
  pour Top (no thermals): 15.88,7.62 16.51,8.26 21.59,8.26 22.23,7.62 22.23,1.91 15.88,1.91
  pour Bottom (no thermals): 15.88,7.62 16.51,8.26 21.59,8.26 22.23,7.62 22.23,1.91 15.88,1.91
+5V  (via drill 0.35)  (6 unrouted)
  Top 0.152: R11.2 59.51,41.15 5VCONVERTER.8,VOUT(+) | 86.44,36.58 R24.2
  Top 0.813: 5VCONVERTER.8,VOUT(+) 5VCONVERTER.7,SENSE+ 54.86,34.79 54.86,10.41 46.41,10.41 C8.1 | C10.1 C9.1 C8.1 | C8.1 44.43,7.52 v44.45,7.49 | P1.3 85.72,40.13 85.72,37.3 | 85.72,37.3 85.97,37.05 86.11,37.05 86.44,36.72 86.44,36.58 | 85.69,37.34 85.72,37.3
  pour Bottom (no thermals): 41.27,7.49 41.91,8.13 46.99,8.13 47.62,7.49 47.62,1.78 41.27,1.78
  pour Top (no thermals): 41.27,7.49 41.91,8.13 46.99,8.13 47.62,7.49 47.62,1.78 41.27,1.78
+12V  (3 unrouted)
  Top 0.152: R20.2 77.07,33.71 | 87.86,83.6 87.72,83.73
  Top 0.508: 64.68,88.39 R10.2 | Q4.2 90.03,82.7 R31.2 85.69,79.63 87.86,81.8 87.86,83.6 | 87.72,83.73 86.53,83.73 85.38,82.58 Q1.2 75.65,86.04 74.17,86.04 73.27,86.94 73.27,88.39 64.68,88.39 | 12VCONVERTER.7,SENSE+ 63.7,87.41 64.68,88.39
  Top 1.905: P1.4 81.61,54.07 81.16,54.52 81.16,57.15 80.85,56.84 C3.1 C4.1 C5.1 | 12VCONVERTER.8,VOUT(+) 12VCONVERTER.7,SENSE+
AGND  (via drill 0.35, 0.9)  (4 unrouted)
  Top 0.152: R9.1 22.86,53.3 v22.86,53.21 21.42,51.78 C19.1 | R7.1 22.7,25.65 v22.61,25.65 | 16,17.27 C14.2 | R26.2 87.08,31.66 v87.12,31.62 | C5.2 C4.2 76.12,59.69 C3.2 | v26.34,47.7 v26.42,47.62 | v25.58,69.47 v27.18,69.47 | v28.25,98.63 v28.32,98.55 | 5V_LED.C v62.74,43.94 | U$2.GND 86.69,12.76 v86.74,12.7 | R27.2 v74.42,14.35 | Q12.2 20.83,56.12 v20.83,55.37 | Q11.2 27.28,31.37 v27.69,31.37 | 12V_LED.C 63.37,91.44 v63.25,91.57 | 3.3V_LED.C 64.39,67.56 v63.75,68.2 | R15.2 R14.2 | R14.2 v90.81,17.65 | C16.2 89.5,15.92 R14.2 | C18.1 20.19,98.64 v20.19,97.41 | C17.1 v20.07,66.04 | R23.2 76.15,30.99 v76.02,31.11 | Q7.2 22.78,79.67 v22.86,79.76 24.04,79.76 R2.1 | R29.2 v64.01,78.23 | R28.2 63.75,33.53 v63.63,33.4 | R30.2 v64.14,53.98 | POWER_LED.C v15.88,40.01 | Q13.2 77.11,77.47 v79.25,77.47 75.86,77.47 C1.1
  Top 0.813: v39.62,15.37 39.67,15.32 C9.2 | C9.2 C10.2 | C9.2 C8.2 | C13.2 16,17.27 | C15.2 C14.2 15.77,17.14 v13.97,17.14
  Top 1.905: C5.2 76.12,59.69 | C3.2 C4.2 74.17,61.72 v72.77,61.72
  Bottom 0.152: v26.34,47.7 1C.GND 1C.BW_SEL | 1C2.BW_SEL 1C2.GND v25.58,69.47 | 1C1.BW_SEL 1C1.GND v28.25,98.63
  other vias: 26.67,7.62 36.83,7.49
  pour Bottom (no thermals): 102.87,103.35 102.87,9.91 -1.02,9.91 -1.02,102.62 -1.02,102.87 0,102.87
  pour Bottom: 23.5,7.62 23.5,10.54 29.84,10.54 29.84,7.24 23.5,7.24
  pour Bottom (no thermals): 23.5,7.62 24.13,8.26 29.21,8.26 29.84,7.62 29.84,1.91 23.5,1.91
  pour Top (no thermals): 23.5,7.62 24.13,8.26 29.21,8.26 29.84,7.62 29.84,1.91 23.5,1.91
  pour Bottom: 33.66,7.49 33.66,10.41 40.01,10.41 40.01,7.11 33.66,7.11
  pour Bottom (no thermals): 33.66,7.49 34.29,8.13 39.37,8.13 40.01,7.49 40.01,1.78 33.66,1.78
  pour Top (no thermals): 33.66,7.49 34.29,8.13 39.37,8.13 40.01,7.49 40.01,1.78 33.66,1.78
JETSON_ON/OFF  (via drill 0.35)  (1 unrouted)
  Top 0.152: 85.34,9.31 v85.34,9.27
  Bottom 0.152: v85.34,9.27 59.69,9.27 59.69,3.39 U$1.18
JETSON_SWITCHED  (1 unrouted)
  Top 0.152: R17.1 78.02,91.06 Q1.3
MOBO_ON/OFF  (via drill 0.35)  (1 unrouted)
  Bottom 0.152: v86.36,8.51 62.23,8.51 62.23,3.39 U$1.19
MOBO_SWITCHED  (2 unrouted)
  Top 1.905: 87.12,55.92 P1.1
N$1
  Top 0.152: R29.1 63.9,83.61 12VCONVERTER.6,TRIM
N$2
  Top 0.152: 58.51,34.54 5VCONVERTER.6,TRIM 60.33,36.45 63.4,36.45 R28.1
N$3
  Top 0.152: 3.3VCONVERTER.6,TRIM 62.44,59.1 64.28,59.1 R30.1
N$4
  Top 0.152: Q12.3 30.53,59.14 3.3VCONVERTER.2,ON/OFF
N$5
  Top 0.152: R10.1 66.28,89.76 12V_LED.A
N$6
  Top 0.152: 5V_LED.A 65.52,41.43 R11.1
N$7
  Top 0.152: 66.41,65.05 R12.1 66.13,67.28 3.3V_LED.A
N$11  (via drill 0.35)
  Top 0.152: 49.4,31.88 v49.47,31.81 v53.59,27.69 | v56.39,27.69 58.45,29.74 65.15,29.74 67.18,31.77 74.78,31.77 74.8,31.75 74.8,25.91 69.22,20.32 69.22,14.91 73.32,10.81 U$2.IN0 | v22.35,45.85 23.11,45.09 31.62,45.09 v32.13,44.58 | v38.1,41.02 44.96,34.16 v44.96,33.02
  Bottom 0.152: v53.59,27.69 v56.39,27.69 | 1C.VIOUT v22.35,45.85 | v32.13,44.58 35.69,41.02 v38.1,41.02 | v44.96,33.02 46.16,31.81 v49.47,31.81
N$12  (via drill 0.35)
  Top 0.152: v53.59,30.35 51.44,32.51 v51.44,48.64 | v56.39,30.35 64.9,30.35 66.93,32.38 75.03,32.38 75.41,32 75.41,25.66 69.85,20.09 69.85,15.14 72.88,12.11 U$2.IN2 | v24.51,97.16 24.77,96.9 34.54,96.9 51.44,80.01 v51.44,51.31
  Bottom 0.152: v53.59,30.35 v56.39,30.35 | 1C1.VIOUT v24.51,97.16 | v51.44,48.64 v51.44,51.31
N$13  (via drill 0.35)
  Top 0.152: v53.59,29.08 53.09,29.08 50.29,31.88 v50.29,48.64 | v56.39,29.08 57.35,30.05 65.02,30.05 67.06,32.08 74.9,32.08 75.11,31.88 75.11,25.78 69.52,20.19 69.55,20.17 69.55,15.01 73.1,11.46 U$2.IN1 | v22.99,70.87 23.88,71.75 31.88,71.75 v32.38,71.25 | v35.05,71.25 45.97,71.25 v46.1,71.37 | v48.9,71.37 50.29,69.98 v50.29,51.31
  Bottom 0.152: v53.59,29.08 v56.39,29.08 | 1C2.VIOUT v22.99,70.87 | v32.38,71.25 v35.05,71.25 | v46.1,71.37 v48.9,71.37 | v50.29,51.31 v50.29,48.64
N$15
  Top 0.152: R6.1 80.64,79.76 | 80.64,79.76 82.59,79.76 R31.1 83.99,79.5 87.13,82.64 Q4.1 | Q13.3 74.56,76.17 78.8,76.17 79.86,77.22 79.86,78.97 80.64,79.76
N$16
  Top 0.152: U$2.IN4 79.43,13.16 79.13,13.16 79.05,13.08 72.77,13.08 70.52,15.33 70.52,18.41 85.3,33.19 R26.1 R24.1
N$17
  Top 0.152: 77.76,14.4 R27.1 | R27.1 78.11,14.06 U$2.IN5 | R27.1 R25.1
N$18
  Top 0.152: 12VCONVERTER.2,ON/OFF 30.52,83.57 22.14,83.57 Q7.3
N$19
  Top 0.152: Q11.3 25.31,34.59 5VCONVERTER.2,ON/OFF
N$20
  Top 0.152: POWER_LED.A 13.37,40.03 R4.1 R5.1
N$21
  Top 0.152: R23.1 78.7,31.04 78.83,31.16 | U$2.IN3 79.62,12.71 72.72,12.71 70.16,15.27 70.16,19.97 78.83,28.64 R23.1 | R23.1 R20.1
N$22
  Top 0.152: R17.2 88.35,91.06 Q4.3
N$23  (1 unrouted)
  Top 0.152: C1.2 78.53,79.38 R6.2
N$24  (2 unrouted)
N$25  (2 unrouted)
N$27  (3 unrouted)
N$28  (2 unrouted)
N$29  (1 unrouted)
N$44
  Top 0.152: 85.45,14.73 U$2.A0 86.33,14.71 87.8,16.17 R14.1 R13.2
N$46  (via drill 0.35)
  Top 0.152: R15.1 87.29,20.7 87.28,20.69 87.27,20.7 R16.2 | 85,20.65 R16.2 | U$2.A1 86.36,16.29 v86.36,16.89 86.36,17.27 | v86.36,18.41 86.36,19.39 R16.2
  Bottom 0.152: v86.36,16.89 v86.36,18.41
PLTA_ON/OFF  (via drill 0.35)  (1 unrouted)
  Top 0.152: 60.72,8.64 v45.59,8.64 | v43.18,8.64 v33.27,8.64
  Bottom 0.152: U$1.7 31.75,8.64 v33.27,8.64 | v45.59,8.64 v43.18,8.64
PLTA_SWITCHED  (2 unrouted)
  Top 1.905: U$1.50 31.75,3.39 31.75,15.49 37.97,21.72 45,21.72
SCL
  Top 0.152: U$2.SCL 86.06,12.11 86.36,11.81 86.36,10.67 85.98,10.29 83.82,10.29 80.03,6.49 U$1.31
SDA
  Top 0.152: U$1.32 77.49,6.62 82.32,11.46 U$2.SDA
V+
  Top 0.152: R8.2 21.02,53.59 18.16,53.59 | R3.2 23.86,29.46 17.78,29.46 | R1.2 23.57,82.25 22.1,80.77 18.54,80.77 | R5.2 R4.2
  pour Top: -0.51,101.6 -0.51,10.03 18.67,10.03 18.67,101.6

### Text on the board
tPlace: 12V | 3.3V | 5V | The Underwater Robotics Team / Center for Automotive Research | Converter Board